# Altium schematic sheet LAN.SchDoc
size A3; Author: HamidFijani; DrawnBy: HamidFijani; SheetNumber: 5; SheetTotal: 13
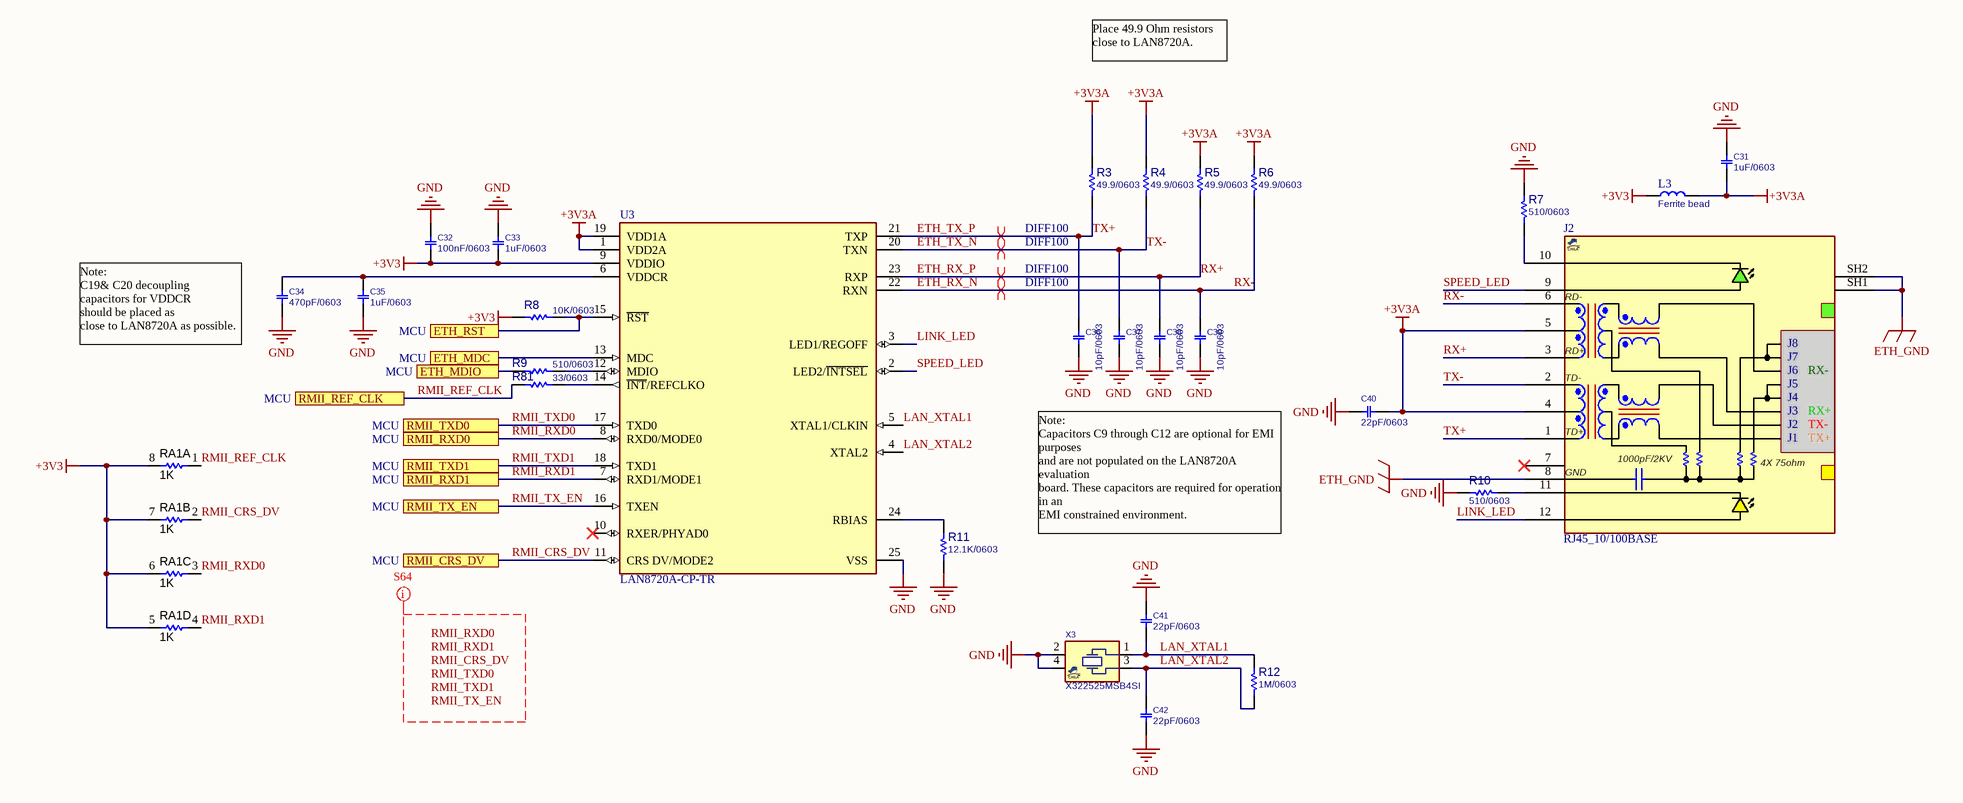
[diagram p0: LAN.SchDoc]

## Parts
?  (no value)  (graphical)
C31  1uF/0603  [C0603]
C32  100nF/0603  [C0603]
C33  1uF/0603  [C0603]
C34  470pF/0603  [C0603]
C35  1uF/0603  [C0603]
C36  10pF/0603  [C0603]
C37  10pF/0603  [C0603]
C38  10pF/0603  [C0603]
C39  10pF/0603  [C0603]
C40  22pF/0603  [C0603]
C41  22pF/0603  [C0603]
C42  22pF/0603  [C0603]
J2  RJ45_10/100BASE  [RJ45_8M_HR911105A]
L3  Ferrite bead  [L0805]
R3  49.9/0603  [R0603]
R4  49.9/0603  [R0603]
R5  49.9/0603  [R0603]
R6  49.9/0603  [R0603]
R7  510/0603  [R0603]
R8  10K/0603  [R0603]
R9  510/0603  [R0603]
R10  510/0603  [R0603]
R11  12.1K/0603  [R0603]
R12  1M/0603  [R0603]
R81  33/0603  [R0603]
RA1  value 1K  [RP0603X4]  (hidden comment: Film Res Pack)  (parts A,B,C,D of 4)
U3  LAN8720A-CP-TR  [FP-24-S4QFN-4x4B-0_5P-IPC_B]
X3  X322525MSB4SI  [XTL_4_3225]

## Ports
ETH_MDC (see MCU), ETH_MDIO (see MCU), ETH_RST (see MCU), RMII_CRS_DV (see MCU), RMII_REF_CLK (see MCU), RMII_RXD0 (see MCU), RMII_RXD1 (see MCU), RMII_TX_EN (see MCU), RMII_TXD0 (see MCU), RMII_TXD1 (see MCU)

## Nets
+3V3: C32.2 C33.2 L3.1 R8.1 RA1.5 RA1.6 RA1.7 RA1.8 U3.9(VDDIO)
+3V3A: C31.2 C40.1 J2.4(TCT) J2.5(RCT) L3.2 R3.2 R4.2 R5.2 R6.2 U3.1(VDD2A) U3.19(VDD1A)
ETH_GND: J2.8(CHSGND) J2.SH1 J2.SH2
GND: C31.1 C32.1 C33.1 C34.2 C35.2 C36.2 C37.2 C38.2 C39.2 C40.2 C41.2 C42.1 R7.2 R10.1 R11.1 U3.25(VSS) X3.2 X3.4
ETH_MDC: U3.13(MDC) ; port ETH_MDC
ETH_MDIO: R9.1 ; port ETH_MDIO
ETH_RST: R8.2 U3.15(~{RST}) ; port ETH_RST
ETH_RX_N: C39.1 J2.6(RD-) R6.1 U3.22(RXN)  [also labelled RX-]
ETH_RX_P: C38.1 J2.3(RD+) R5.1 U3.23(RXP)  [also labelled RX+]
ETH_TX_N: C37.1 J2.2(TD-) R4.1 U3.20(TXN)  [also labelled TX-]
ETH_TX_P: C36.1 J2.1(TD+) R3.1 U3.21(TXP)  [also labelled TX+]
LAN_XTAL1: C41.1 R12.2 U3.5(XTAL1/CLKIN) X3.1
LAN_XTAL2: C42.2 R12.1 U3.4(XTAL2) X3.3
LINK_LED: J2.12(YLED+) U3.3(LED1/REGOFF)
RMII_CRS_DV: RA1.2 U3.11(CRS_DV/MODE2) ; port RMII_CRS_DV
RMII_REF_CLK: R81.1 RA1.1 ; port RMII_REF_CLK
RMII_RXD0: RA1.3 U3.8(RXD0/MODE0) ; port RMII_RXD0
RMII_RXD1: RA1.4 U3.7(RXD1/MODE1) ; port RMII_RXD1
RMII_TX_EN: U3.16(TXEN) ; port RMII_TX_EN
RMII_TXD0: U3.17(TXD0) ; port RMII_TXD0
RMII_TXD1: U3.18(TXD1) ; port RMII_TXD1
SPEED_LED: J2.9(GLED+) U3.2(LED2/~{INTSEL})
NetC34_1: C34.1 C35.1 U3.6(VDDCR)
NetJ2_10: J2.10(GLED-) R7.1
NetJ2_11: J2.11(YLED-) R10.2
NetR9_2: R9.2 U3.12(MDIO)
NetR11_2: R11.2 U3.24(RBIAS)
NetR81_2: R81.2 U3.14(~{INT}/REFCLKO)

Not connected (* = marked no-connect by the designer): J2 7(NC)*; U3 10(RXER/PHYAD0)*

## Layout directives
differential pair; differential pair class DIFF100: ETH_RX_N, ETH_RX_P, ETH_TX_N, ETH_TX_P
net class S64: RMII_CRS_DV, RMII_RXD0, RMII_RXD1, RMII_TX_EN, RMII_TXD0, RMII_TXD1

## Notes on the sheet
- Place 49.9 Ohm resistors
  close to LAN8720A.
- (near C34) Note:
  C19& C20 decoupling
  capacitors for VDDCR
  should be placed as
  close to LAN8720A as possible.
- Note:
  Capacitors C9 through C12 are optional for EMI purposes
  and are not populated on the LAN8720A evaluation
  board. These capacitors are required for operation in an
  EMI constrained environment.
- Labels drawn without touching a wire or pin: RMII_CRS_DV, RMII_RXD0, RMII_RXD1, RMII_TX_EN, RMII_TXD0, RMII_TXD1
- Title:
- Page Contents:
- Variant:
- Checked by
- Size:
- Date:
- DWG NO
- Sheet
- of
- Revision:
- (in symbol RJ45_HR911105A) J8; J7; J6; RX-; J5; J4; J3; RX+; TX-; J1; TX+; 1000pF/2KV; 4X 75ohm; GND

## Library data of the parts
? = SDTitleBlock
C31-C42 = CAP_SMD_MLCC_0603: CAP, MLCC; PARAM: -, -%; MANF_P#: MANF_PART#; PARAM2: -V; PRICE: 100= 1$; MANF: -; ASSEMBLY: ASSEMBLY
  C31 C33 C35: VALUE: 1uF/0603
  C32: VALUE: 100nF/0603
  C34: VALUE: 470pF/0603
  C36-C39: VALUE: 10pF/0603
  C40-C42: VALUE: 22pF/0603
J2 = RJ45_HR911105A: RJ45, 10/100BASE, G/Y LED; MANF: Hanrun; MANF_P#: HR911105A; PARAM2: 10/100BASE, G/Y LED; VALUE: RJ45_10/100BASE
L3 = IND_SMD: INDUCTOR, SMD; VALUE: Ferrite bead
R3-R12 R81 = RES_SMD_0603: RESISTOR, SMD; PARAM: 1%, 0.1W; DESC: DESCRIPTION; DIST#: MOUSER; MANF_P#: -; MANF: -; ASSEMBLY: ASSEMBLY; PRICE: -; PARAM2: -
  R3-R6: VALUE: 49.9/0603
  R7 R9 R10: VALUE: 510/0603
  R8: VALUE: 10K/0603
  R11: VALUE: 12.1K/0603
  R12: VALUE: 1M/0603
  R81: VALUE: 33/0603
RA1 = RES_SMD_PACK_X4: RESISTOR, SMD, PACKX4; MANF_P#: MANF_PART#; MANF: MANF
U3 = CMP-06281-000046-1: IC TRANSCEIVER FULL 2/2 24SQFN; Simplex/Duplex: Full Duplex; Min Supply Voltage: 1.14V; Data Rate: 100Mbps; Max Supply Current: 21mA; Operating Supply Voltage: 1.2V; Number of Transceivers: 1; Max Supply Voltage: 1.26V; Mount: Surface Mount; Packaging: Tape and Reel; Max Operating Temperature: 85°C; RoHS Compliant: Yes; Min Operating Temperature: -40°C; Number of Pins: 24; Weight: 0.032741oz; Package Quantity: 5000; Case/Package: QFN
X3 = XTL_4_24MHz_3225A: Crystal 24MHz; MANF: ABRACON; MANF_P#: ABM8W-24.0000MHZ-4-D1X-T3; PARAM2: 10PPM, 4pF; PARAM: -40~85oC; PRICE: 0.7$; VALUE: X322525MSB4SI